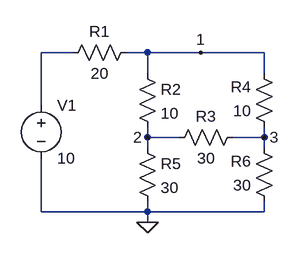
[diagram p0: schematic circuit-5.asc]
circuit-5.asc, the LTspice schematic file:
Version 4
SHEET 1 880 680
WIRE -16 112 -64 112
WIRE 96 112 64 112
WIRE 176 112 96 112
WIRE 272 112 176 112
WIRE 96 144 96 112
WIRE 272 144 272 112
WIRE -64 192 -64 112
WIRE 96 240 96 224
WIRE 144 240 96 240
WIRE 272 240 272 224
WIRE 272 240 224 240
WIRE 96 256 96 240
WIRE 272 256 272 240
WIRE -64 352 -64 272
WIRE 96 352 96 336
WIRE 96 352 -64 352
WIRE 272 352 272 336
WIRE 272 352 96 352
WIRE 96 368 96 352
FLAG 96 368 0
FLAG 176 112 1
FLAG 96 240 2
FLAG 272 240 3
SYMBOL res 80 96 R90
WINDOW 0 0 56 VBottom 2
WINDOW 3 32 56 VTop 2
SYMATTR InstName R1
SYMATTR Value 20
SYMBOL res 80 128 R0
SYMATTR InstName R2
SYMATTR Value 10
SYMBOL res 240 224 R90
WINDOW 0 0 56 VBottom 2
WINDOW 3 32 56 VTop 2
SYMATTR InstName R3
SYMATTR Value 30
SYMBOL res 288 240 R180
WINDOW 0 36 76 Left 2
WINDOW 3 36 40 Left 2
SYMATTR InstName R4
SYMATTR Value 10
SYMBOL res 80 240 R0
SYMATTR InstName R5
SYMATTR Value 30
SYMBOL res 288 352 R180
WINDOW 0 36 76 Left 2
WINDOW 3 36 40 Left 2
SYMATTR InstName R6
SYMATTR Value 30
SYMBOL voltage -64 176 R0
SYMATTR InstName V1
SYMATTR Value 10

The netlist it stands for:
* circuit-5.asc
R1 1 N001 20
R2 1 2 10
R3 3 2 30
R4 3 1 10
R5 2 0 30
R6 0 3 30
V1 N001 0 10
.backanno
.end